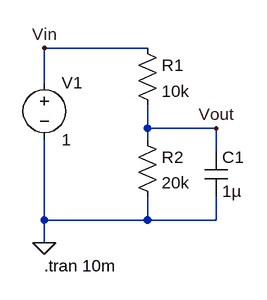
[diagram p0: schematic q3a.asc]
q3a.asc, the LTspice schematic file:
Version 4
SHEET 1 880 680
WIRE 448 208 304 208
WIRE 304 256 304 208
WIRE 448 320 448 288
WIRE 544 320 448 320
WIRE 448 336 448 320
WIRE 544 352 544 320
WIRE 304 448 304 336
WIRE 448 448 448 416
WIRE 448 448 304 448
WIRE 544 448 544 416
WIRE 544 448 448 448
WIRE 304 480 304 448
FLAG 304 480 0
FLAG 304 208 Vin
FLAG 544 320 Vout
SYMBOL res 432 192 R0
SYMATTR InstName R1
SYMATTR Value 10k
SYMBOL res 432 320 R0
SYMATTR InstName R2
SYMATTR Value 20k
SYMBOL voltage 304 240 R0
SYMATTR InstName V1
SYMATTR Value 1
SYMATTR Value2 AC 1V
SYMBOL cap 528 352 R0
SYMATTR InstName C1
SYMATTR Value 1µ
TEXT 304 512 Left 2 !.tran 10m

The netlist it stands for:
* q3a.asc
R1 Vin Vout 10k
R2 Vout 0 20k
V1 Vin 0 1 AC 1V
C1 Vout 0 1µ
.tran 10m
.backanno
.end